# Altium schematic sheet LED_STATUS_OUTPUTS.SchDoc
size A4; SheetNumber: 12; SheetTotal: 14
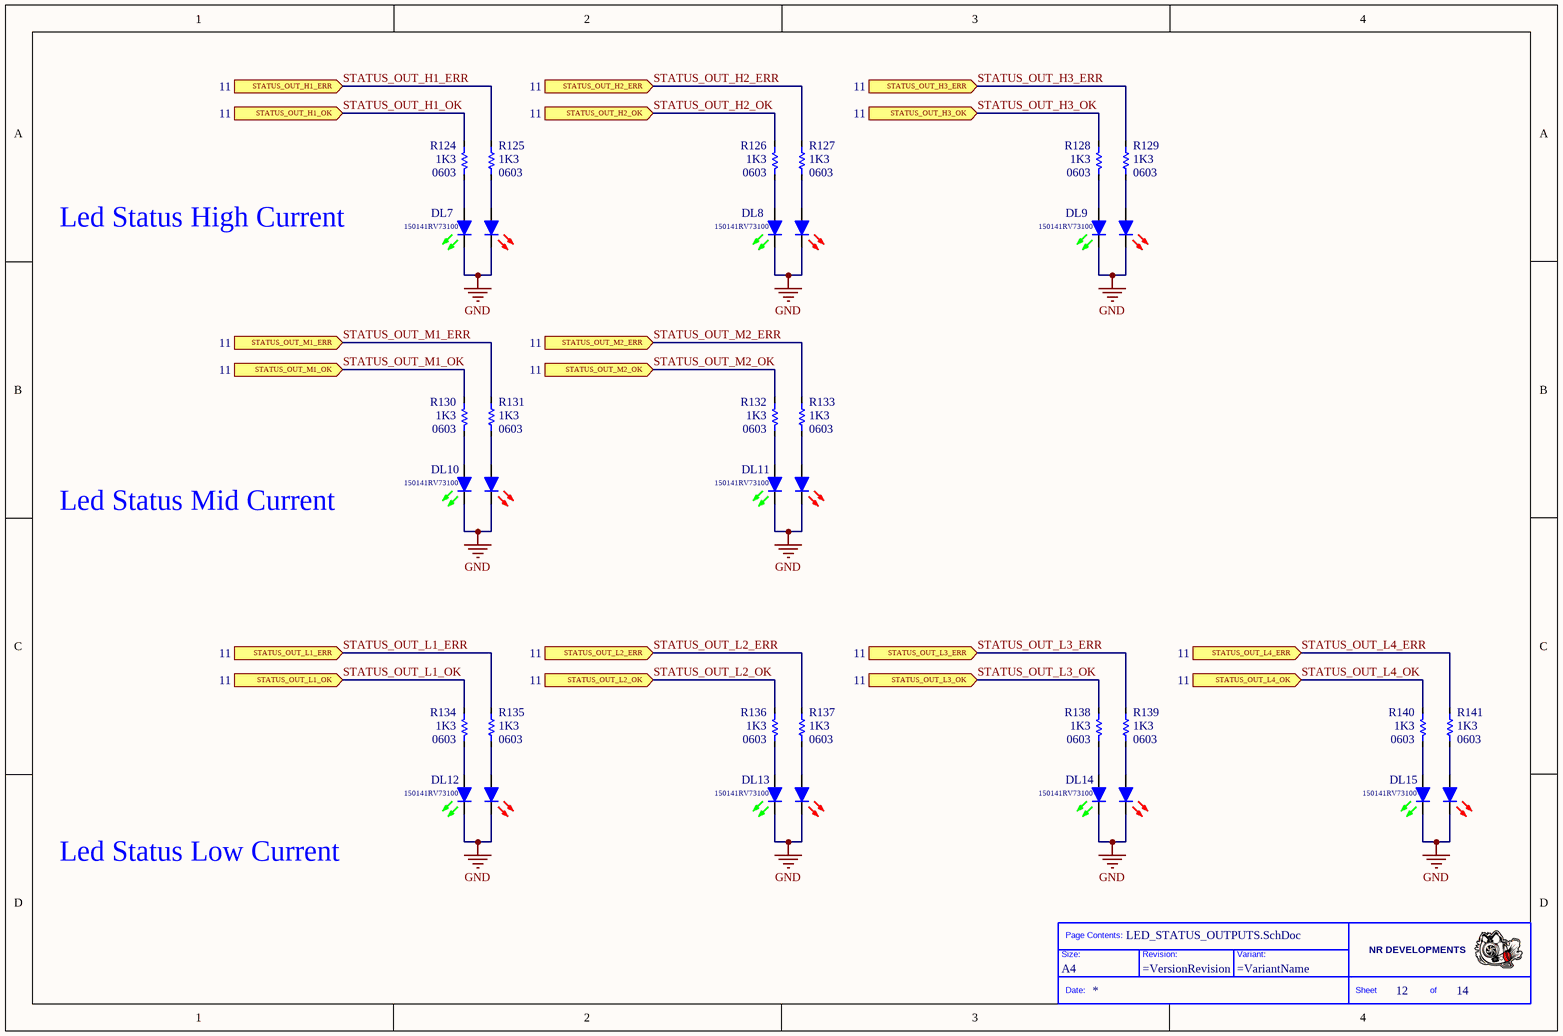
[diagram p0: LED_STATUS_OUTPUTS.SchDoc]

## Parts
*  Size: A4  (hidden comment: Title_Block)  (graphical)
DL7  value 150141RV73100  [WURTH-SBTW_3528]  (hidden comment: LED_Red_Green)
DL8  value 150141RV73100  [WURTH-SBTW_3528]  (hidden comment: LED_Red_Green)
DL9  value 150141RV73100  [WURTH-SBTW_3528]  (hidden comment: LED_Red_Green)
DL10  value 150141RV73100  [WURTH-SBTW_3528]  (hidden comment: LED_Red_Green)
DL11  value 150141RV73100  [WURTH-SBTW_3528]  (hidden comment: LED_Red_Green)
DL12  value 150141RV73100  [WURTH-SBTW_3528]  (hidden comment: LED_Red_Green)
DL13  value 150141RV73100  [WURTH-SBTW_3528]  (hidden comment: LED_Red_Green)
DL14  value 150141RV73100  [WURTH-SBTW_3528]  (hidden comment: LED_Red_Green)
DL15  value 150141RV73100  [WURTH-SBTW_3528]  (hidden comment: LED_Red_Green)
R124  value 1K3  Case: 0603  [RESC1608X06M]  (hidden comment: Res)
R125  value 1K3  Case: 0603  [RESC1608X06M]  (hidden comment: Res)
R126  value 1K3  Case: 0603  [RESC1608X06M]  (hidden comment: Res)
R127  value 1K3  Case: 0603  [RESC1608X06M]  (hidden comment: Res)
R128  value 1K3  Case: 0603  [RESC1608X06M]  (hidden comment: Res)
R129  value 1K3  Case: 0603  [RESC1608X06M]  (hidden comment: Res)
R130  value 1K3  Case: 0603  [RESC1608X06M]  (hidden comment: Res)
R131  value 1K3  Case: 0603  [RESC1608X06M]  (hidden comment: Res)
R132  value 1K3  Case: 0603  [RESC1608X06M]  (hidden comment: Res)
R133  value 1K3  Case: 0603  [RESC1608X06M]  (hidden comment: Res)
R134  value 1K3  Case: 0603  [RESC1608X06M]  (hidden comment: Res)
R135  value 1K3  Case: 0603  [RESC1608X06M]  (hidden comment: Res)
R136  value 1K3  Case: 0603  [RESC1608X06M]  (hidden comment: Res)
R137  value 1K3  Case: 0603  [RESC1608X06M]  (hidden comment: Res)
R138  value 1K3  Case: 0603  [RESC1608X06M]  (hidden comment: Res)
R139  value 1K3  Case: 0603  [RESC1608X06M]  (hidden comment: Res)
R140  value 1K3  Case: 0603  [RESC1608X06M]  (hidden comment: Res)
R141  value 1K3  Case: 0603  [RESC1608X06M]  (hidden comment: Res)

## Ports
STATUS_OUT_H1_ERR (in, see 11), STATUS_OUT_H1_OK (in, see 11), STATUS_OUT_H2_ERR (in, see 11), STATUS_OUT_H2_OK (in, see 11), STATUS_OUT_H3_ERR (in, see 11), STATUS_OUT_H3_OK (in, see 11), STATUS_OUT_L1_ERR (in, see 11), STATUS_OUT_L1_OK (in, see 11), STATUS_OUT_L2_ERR (in, see 11), STATUS_OUT_L2_OK (in, see 11), STATUS_OUT_L3_ERR (in, see 11), STATUS_OUT_L3_OK (in, see 11), STATUS_OUT_L4_ERR (in, see 11), STATUS_OUT_L4_OK (in, see 11), STATUS_OUT_M1_ERR (in, see 11), STATUS_OUT_M1_OK (in, see 11), STATUS_OUT_M2_ERR (in, see 11), STATUS_OUT_M2_OK (in, see 11)

## Nets
GND: DL7.C1 DL7.C2 DL8.C1 DL8.C2 DL9.C1 DL9.C2 DL10.C1 DL10.C2 DL11.C1 DL11.C2 DL12.C1 DL12.C2 DL13.C1 DL13.C2 DL14.C1 DL14.C2 DL15.C1 DL15.C2
STATUS_OUT_H1_ERR: R125.2 ; port STATUS_OUT_H1_ERR
STATUS_OUT_H1_OK: R124.2 ; port STATUS_OUT_H1_OK
STATUS_OUT_H2_ERR: R127.2 ; port STATUS_OUT_H2_ERR
STATUS_OUT_H2_OK: R126.2 ; port STATUS_OUT_H2_OK
STATUS_OUT_H3_ERR: R129.2 ; port STATUS_OUT_H3_ERR
STATUS_OUT_H3_OK: R128.2 ; port STATUS_OUT_H3_OK
STATUS_OUT_L1_ERR: R135.2 ; port STATUS_OUT_L1_ERR
STATUS_OUT_L1_OK: R134.2 ; port STATUS_OUT_L1_OK
STATUS_OUT_L2_ERR: R137.2 ; port STATUS_OUT_L2_ERR
STATUS_OUT_L2_OK: R136.2 ; port STATUS_OUT_L2_OK
STATUS_OUT_L3_ERR: R139.2 ; port STATUS_OUT_L3_ERR
STATUS_OUT_L3_OK: R138.2 ; port STATUS_OUT_L3_OK
STATUS_OUT_L4_ERR: R141.2 ; port STATUS_OUT_L4_ERR
STATUS_OUT_L4_OK: R140.2 ; port STATUS_OUT_L4_OK
STATUS_OUT_M1_ERR: R131.2 ; port STATUS_OUT_M1_ERR
STATUS_OUT_M1_OK: R130.2 ; port STATUS_OUT_M1_OK
STATUS_OUT_M2_ERR: R133.2 ; port STATUS_OUT_M2_ERR
STATUS_OUT_M2_OK: R132.2 ; port STATUS_OUT_M2_OK
NetDL7_A1: DL7.A1 R125.1
NetDL7_A2: DL7.A2 R124.1
NetDL8_A1: DL8.A1 R127.1
NetDL8_A2: DL8.A2 R126.1
NetDL9_A1: DL9.A1 R129.1
NetDL9_A2: DL9.A2 R128.1
NetDL10_A1: DL10.A1 R131.1
NetDL10_A2: DL10.A2 R130.1
NetDL11_A1: DL11.A1 R133.1
NetDL11_A2: DL11.A2 R132.1
NetDL12_A1: DL12.A1 R135.1
NetDL12_A2: DL12.A2 R134.1
NetDL13_A1: DL13.A1 R137.1
NetDL13_A2: DL13.A2 R136.1
NetDL14_A1: DL14.A1 R139.1
NetDL14_A2: DL14.A2 R138.1
NetDL15_A1: DL15.A1 R141.1
NetDL15_A2: DL15.A2 R140.1

## Notes on the sheet
- Led Status High Current
- Led Status Mid Current
- Led Status Low Current
- (in symbol Title_Block) Page Contents:; NR DEVELOPMENTS; Size:; Revision:; Variant:; Date:; Sheet; of

## Library data of the parts
DL7-DL15 = LED_Red_Green: Led Red - Green 3528; Manufacturer: Wurth; PartNumber: 150141RV73100; Case: 3528
R124-R141 = Resistor: Manufacturer: Vishay; PartNumber: RC0603FR-071K3L